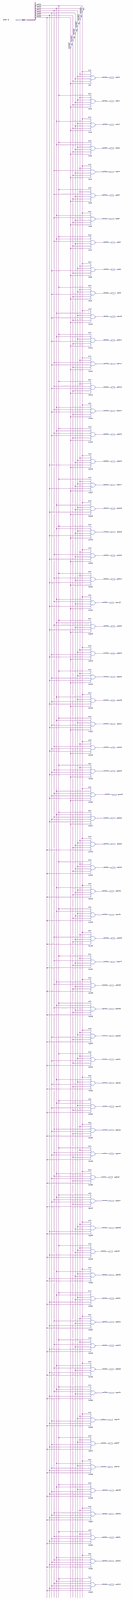
[diagram p0: schematic sheet, whole]
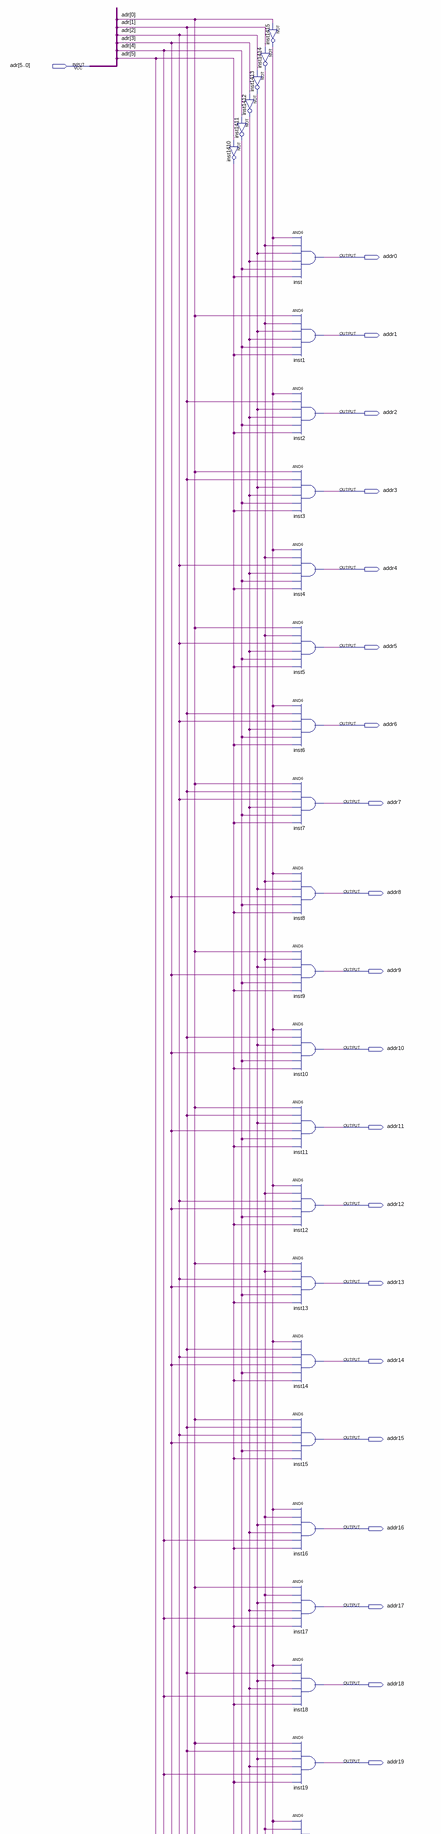
[diagram p1: schematic sheet, upper part]
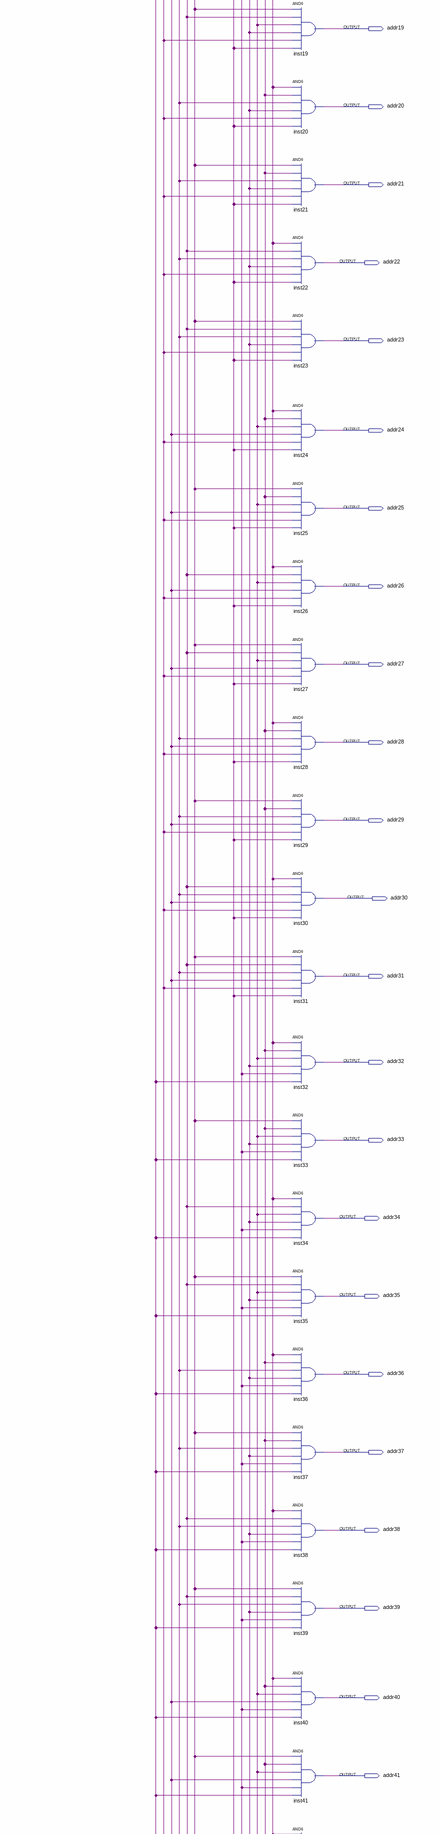
[diagram p2: schematic sheet, middle part]
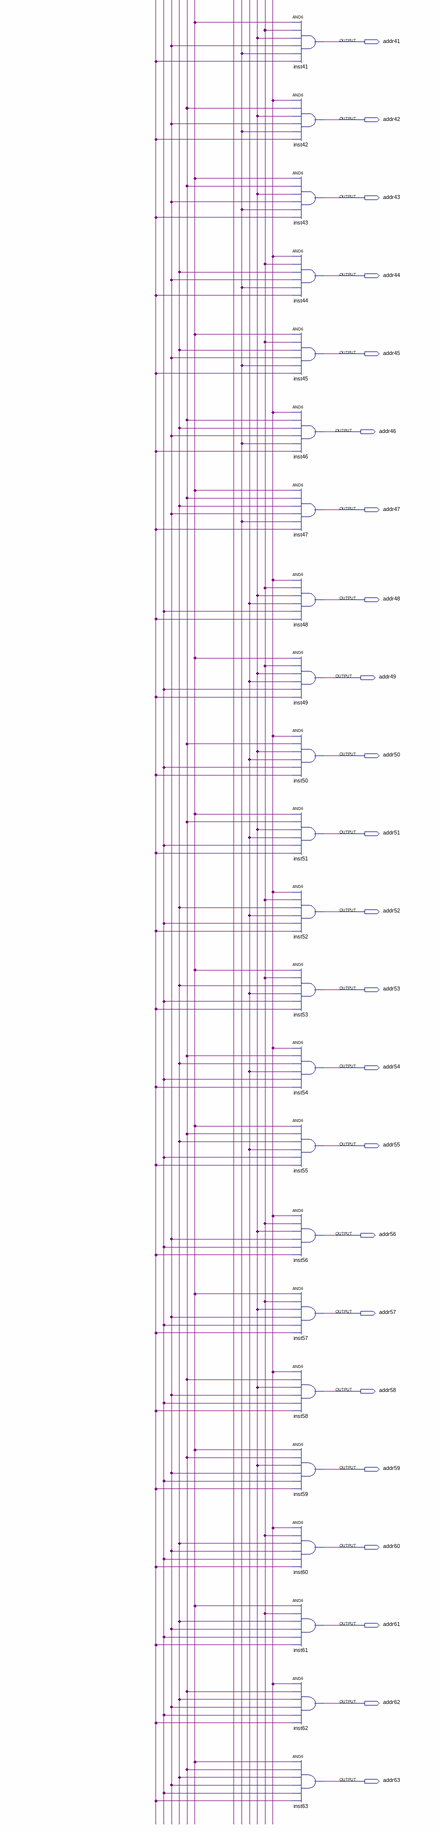
[diagram p3: schematic sheet, lower part]
// Quartus schematic ymq6.bdf as structural Verilog: 70 symbols, 65 pins
module ymq6 (
  input  [5:0] adr,
  output addr0,
  output addr1,
  output addr2,
  output addr3,
  output addr4,
  output addr5,
  output addr6,
  output addr7,
  output addr8,
  output addr9,
  output addr10,
  output addr11,
  output addr12,
  output addr13,
  output addr14,
  output addr15,
  output addr16,
  output addr17,
  output addr18,
  output addr19,
  output addr20,
  output addr21,
  output addr22,
  output addr23,
  output addr24,
  output addr25,
  output addr26,
  output addr27,
  output addr28,
  output addr29,
  output addr30,
  output addr31,
  output addr32,
  output addr33,
  output addr34,
  output addr35,
  output addr36,
  output addr37,
  output addr38,
  output addr39,
  output addr40,
  output addr41,
  output addr42,
  output addr43,
  output addr44,
  output addr45,
  output addr46,
  output addr47,
  output addr48,
  output addr49,
  output addr50,
  output addr51,
  output addr52,
  output addr53,
  output addr54,
  output addr55,
  output addr56,
  output addr57,
  output addr58,
  output addr59,
  output addr60,
  output addr61,
  output addr62,
  output addr63
);

  wire inst1410_out, inst1411_out, inst1412_out, inst1413_out, inst1414_out, inst1415_out;

  not inst1410 (inst1410_out, adr[5]);
  not inst1414 (inst1414_out, adr[1]);
  not inst1413 (inst1413_out, adr[2]);
  not inst1412 (inst1412_out, adr[3]);
  not inst1411 (inst1411_out, adr[4]);
  not inst1415 (inst1415_out, adr[0]);
  and inst (addr0, inst1415_out, inst1414_out, inst1413_out, inst1412_out, inst1411_out, inst1410_out);
  and inst1 (addr1, adr[0], inst1414_out, inst1413_out, inst1412_out, inst1411_out, inst1410_out);
  and inst2 (addr2, inst1415_out, adr[1], inst1413_out, inst1412_out, inst1411_out, inst1410_out);
  and inst3 (addr3, adr[0], adr[1], inst1413_out, inst1412_out, inst1411_out, inst1410_out);
  and inst4 (addr4, inst1415_out, inst1414_out, adr[2], inst1412_out, inst1411_out, inst1410_out);
  and inst5 (addr5, adr[0], inst1414_out, adr[2], inst1412_out, inst1411_out, inst1410_out);
  and inst6 (addr6, inst1415_out, adr[1], adr[2], inst1412_out, inst1411_out, inst1410_out);
  and inst7 (addr7, adr[0], adr[1], adr[2], inst1412_out, inst1411_out, inst1410_out);
  and inst8 (addr8, inst1415_out, inst1414_out, inst1413_out, adr[3], inst1411_out, inst1410_out);
  and inst9 (addr9, adr[0], inst1414_out, inst1413_out, adr[3], inst1411_out, inst1410_out);
  and inst10 (addr10, inst1415_out, adr[1], inst1413_out, adr[3], inst1411_out, inst1410_out);
  and inst11 (addr11, adr[0], adr[1], inst1413_out, adr[3], inst1411_out, inst1410_out);
  and inst12 (addr12, inst1415_out, inst1414_out, adr[2], adr[3], inst1411_out, inst1410_out);
  and inst13 (addr13, adr[0], inst1414_out, adr[2], adr[3], inst1411_out, inst1410_out);
  and inst14 (addr14, inst1415_out, adr[1], adr[2], adr[3], inst1411_out, inst1410_out);
  and inst15 (addr15, adr[0], adr[1], adr[2], adr[3], inst1411_out, inst1410_out);
  and inst16 (addr16, inst1415_out, inst1414_out, inst1413_out, inst1412_out, adr[4], inst1410_out);
  and inst17 (addr17, adr[0], inst1414_out, inst1413_out, inst1412_out, adr[4], inst1410_out);
  and inst18 (addr18, inst1415_out, adr[1], inst1413_out, inst1412_out, adr[4], inst1410_out);
  and inst19 (addr19, adr[0], adr[1], inst1413_out, inst1412_out, adr[4], inst1410_out);
  and inst20 (addr20, inst1415_out, inst1414_out, adr[2], inst1412_out, adr[4], inst1410_out);
  and inst21 (addr21, adr[0], inst1414_out, adr[2], inst1412_out, adr[4], inst1410_out);
  and inst22 (addr22, inst1415_out, adr[1], adr[2], inst1412_out, adr[4], inst1410_out);
  and inst23 (addr23, adr[0], adr[1], adr[2], inst1412_out, adr[4], inst1410_out);
  and inst24 (addr24, inst1415_out, inst1414_out, inst1413_out, adr[3], adr[4], inst1410_out);
  and inst25 (addr25, adr[0], inst1414_out, inst1413_out, adr[3], adr[4], inst1410_out);
  and inst26 (addr26, inst1415_out, adr[1], inst1413_out, adr[3], adr[4], inst1410_out);
  and inst27 (addr27, adr[0], adr[1], inst1413_out, adr[3], adr[4], inst1410_out);
  and inst28 (addr28, inst1415_out, inst1414_out, adr[2], adr[3], adr[4], inst1410_out);
  and inst29 (addr29, adr[0], inst1414_out, adr[2], adr[3], adr[4], inst1410_out);
  and inst30 (addr30, inst1415_out, adr[1], adr[2], adr[3], adr[4], inst1410_out);
  and inst31 (addr31, adr[0], adr[1], adr[2], adr[3], adr[4], inst1410_out);
  and inst32 (addr32, inst1415_out, inst1414_out, inst1413_out, inst1412_out, inst1411_out, adr[5]);
  and inst33 (addr33, adr[0], inst1414_out, inst1413_out, inst1412_out, inst1411_out, adr[5]);
  and inst34 (addr34, inst1415_out, adr[1], inst1413_out, inst1412_out, inst1411_out, adr[5]);
  and inst35 (addr35, adr[0], adr[1], inst1413_out, inst1412_out, inst1411_out, adr[5]);
  and inst36 (addr36, inst1415_out, inst1414_out, adr[2], inst1412_out, inst1411_out, adr[5]);
  and inst37 (addr37, adr[0], inst1414_out, adr[2], inst1412_out, inst1411_out, adr[5]);
  and inst38 (addr38, inst1415_out, adr[1], adr[2], inst1412_out, inst1411_out, adr[5]);
  and inst39 (addr39, adr[0], adr[1], adr[2], inst1412_out, inst1411_out, adr[5]);
  and inst40 (addr40, inst1415_out, inst1414_out, inst1413_out, adr[3], inst1411_out, adr[5]);
  and inst41 (addr41, adr[0], inst1414_out, inst1413_out, adr[3], inst1411_out, adr[5]);
  and inst42 (addr42, inst1415_out, adr[1], inst1413_out, adr[3], inst1411_out, adr[5]);
  and inst43 (addr43, adr[0], adr[1], inst1413_out, adr[3], inst1411_out, adr[5]);
  and inst44 (addr44, inst1415_out, inst1414_out, adr[2], adr[3], inst1411_out, adr[5]);
  and inst45 (addr45, adr[0], inst1414_out, adr[2], adr[3], inst1411_out, adr[5]);
  and inst46 (addr46, inst1415_out, adr[1], adr[2], adr[3], inst1411_out, adr[5]);
  and inst47 (addr47, adr[0], adr[1], adr[2], adr[3], inst1411_out, adr[5]);
  and inst48 (addr48, inst1415_out, inst1414_out, inst1413_out, inst1412_out, adr[4], adr[5]);
  and inst49 (addr49, adr[0], inst1414_out, inst1413_out, inst1412_out, adr[4], adr[5]);
  and inst50 (addr50, inst1415_out, adr[1], inst1413_out, inst1412_out, adr[4], adr[5]);
  and inst51 (addr51, adr[0], adr[1], inst1413_out, inst1412_out, adr[4], adr[5]);
  and inst52 (addr52, inst1415_out, inst1414_out, adr[2], inst1412_out, adr[4], adr[5]);
  and inst53 (addr53, adr[0], inst1414_out, adr[2], inst1412_out, adr[4], adr[5]);
  and inst54 (addr54, inst1415_out, adr[1], adr[2], inst1412_out, adr[4], adr[5]);
  and inst55 (addr55, adr[0], adr[1], adr[2], inst1412_out, adr[4], adr[5]);
  and inst56 (addr56, inst1415_out, inst1414_out, inst1413_out, adr[3], adr[4], adr[5]);
  and inst57 (addr57, adr[0], inst1414_out, inst1413_out, adr[3], adr[4], adr[5]);
  and inst58 (addr58, inst1415_out, adr[1], inst1413_out, adr[3], adr[4], adr[5]);
  and inst59 (addr59, adr[0], adr[1], inst1413_out, adr[3], adr[4], adr[5]);
  and inst60 (addr60, inst1415_out, inst1414_out, adr[2], adr[3], adr[4], adr[5]);
  and inst61 (addr61, adr[0], inst1414_out, adr[2], adr[3], adr[4], adr[5]);
  and inst62 (addr62, inst1415_out, adr[1], adr[2], adr[3], adr[4], adr[5]);
  and inst63 (addr63, adr[0], adr[1], adr[2], adr[3], adr[4], adr[5]);
endmodule
